# EAGLE design V4-AddOnZigbee-SMD-V001 (EAGLE 9.3.0)
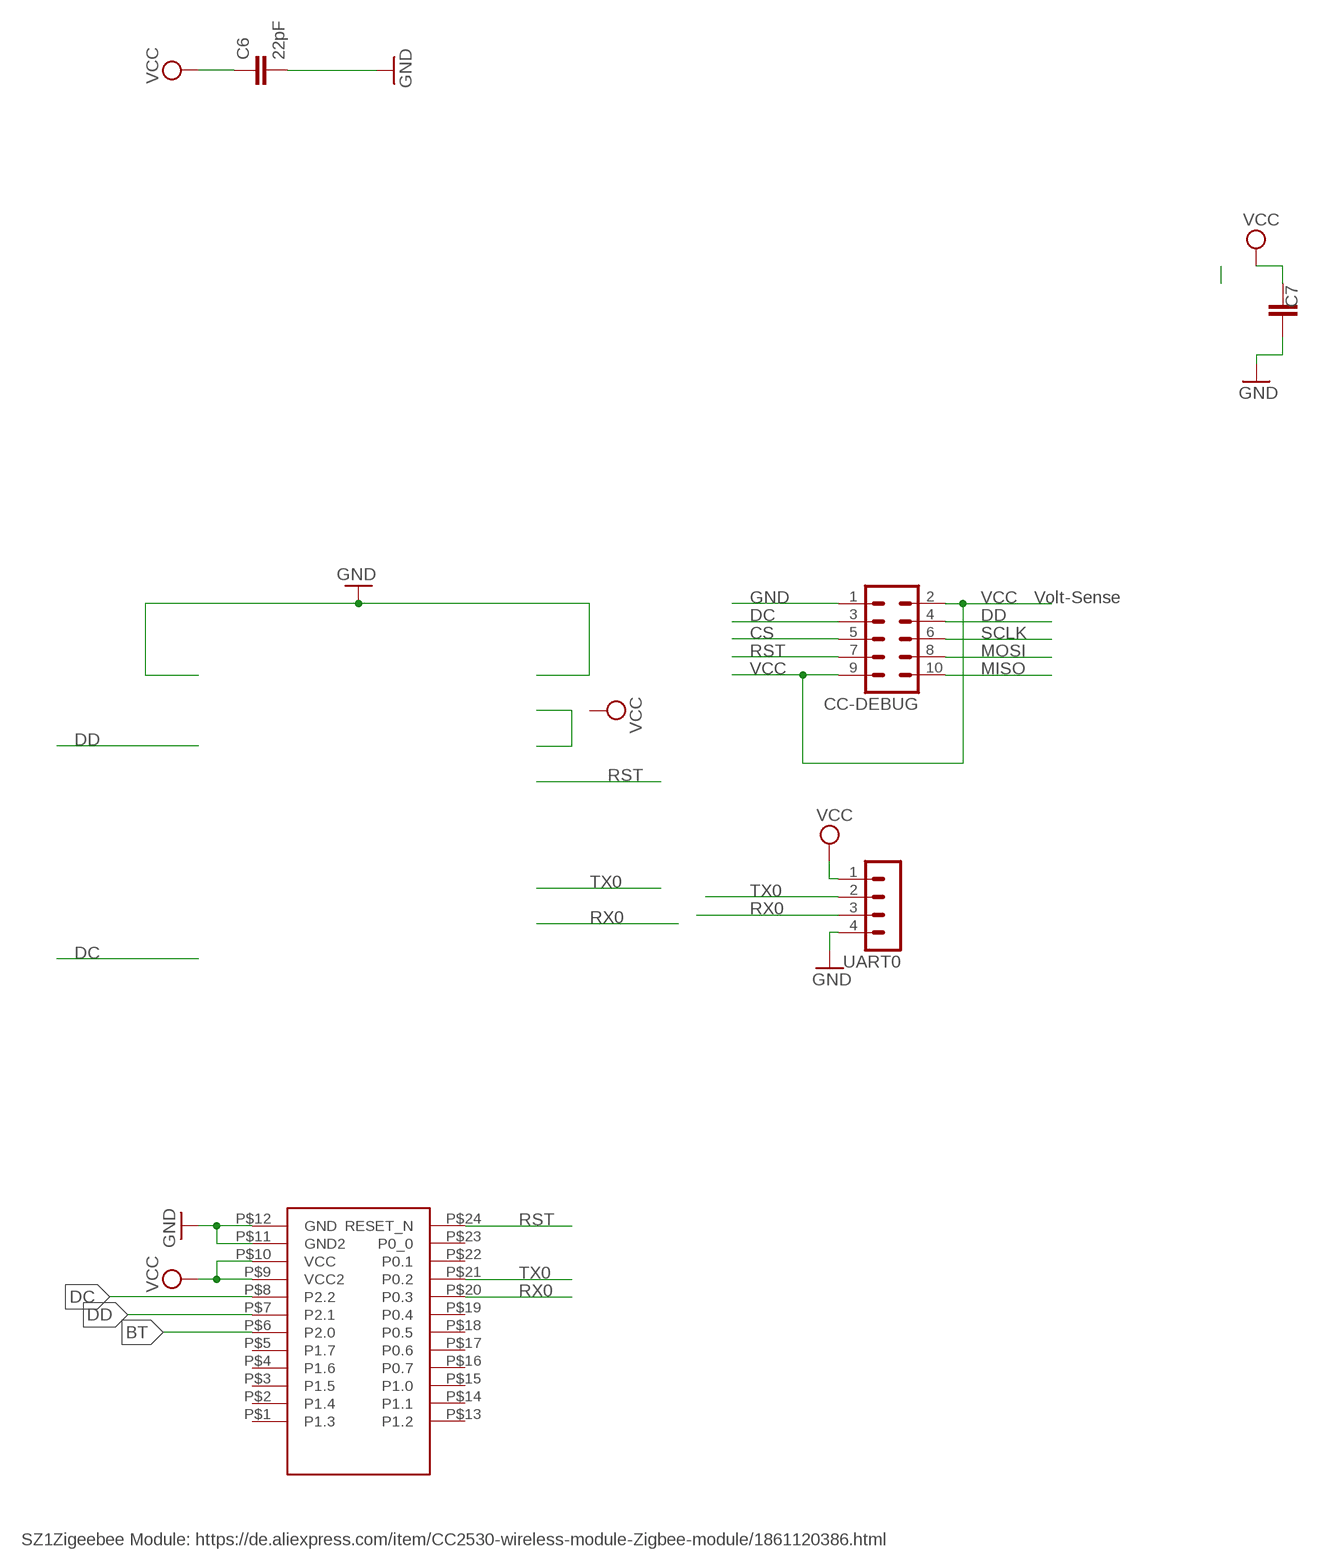
[diagram p0: schematic, sheet 1]

## Parts
C6  22pF  C-EUC0805  [C0805]
C7  C-EUC1812  [C1812]
CC-DEBUG  MA05-2  [MA05-2]
U$1  CC2530CC2530PA  [CC2530PA]
UART0  MA04-1  [MA04-1]

## Nets
BT: U$1.P$6(P2.0)
CS: CC-DEBUG.5
DC: CC-DEBUG.3 U$1.P$8(P2.2)
DD: CC-DEBUG.4 U$1.P$7(P2.1)
GND [PWR]: C6.2 C7.1 CC-DEBUG.1 U$1.P$11(GND2) U$1.P$12(GND) UART0.4
MISO: CC-DEBUG.10
MOSI: CC-DEBUG.8
RST: CC-DEBUG.7 U$1.P$24(RESET_N)
RX0: U$1.P$20(P0.3) UART0.3
SCLK: CC-DEBUG.6
TX0: U$1.P$21(P0.2) UART0.2
VCC [PWR]: C6.1 C7.2 CC-DEBUG.2 CC-DEBUG.9 U$1.P$9(VCC2) U$1.P$10(VCC) UART0.1
Unconnected: U$1.P$1(P1.3) U$1.P$2(P1.4) U$1.P$3(P1.5) U$1.P$4(P1.6) U$1.P$5(P1.7) U$1.P$13(P1.2) U$1.P$14(P1.1) U$1.P$15(P1.0) U$1.P$16(P0.7) U$1.P$17(P0.6) U$1.P$18(P0.5) U$1.P$19(P0.4) U$1.P$22(P0.1) U$1.P$23(P0_0)

## Notes on the sheet
- Volt-Sense
- SZ1Zigeebee Module: https://de.aliexpress.com/item/CC2530-wireless-module-Zigbee-module/1861120386.html

## Library data of the parts
C6 C7 = rcl:C-EU: CAPACITOR, European symbol; SPICEPREFIX: C
CC-DEBUG = con-lstb:MA05-2: PIN HEADER; OC_FARNELL: unknown; OC_NEWARK: unknown
U$1 = zigbee:CC2530: CC2530 Wireless Zigbee Module 3.0-3.6V 2.405-2.485GHz
UART0 = con-lstb:MA04-1: PIN HEADER; OC_FARNELL: unknown; OC_NEWARK: unknown

## Net classes
0 default: width 0.305 mm
1 PWR: width 0.61 mm

## Board
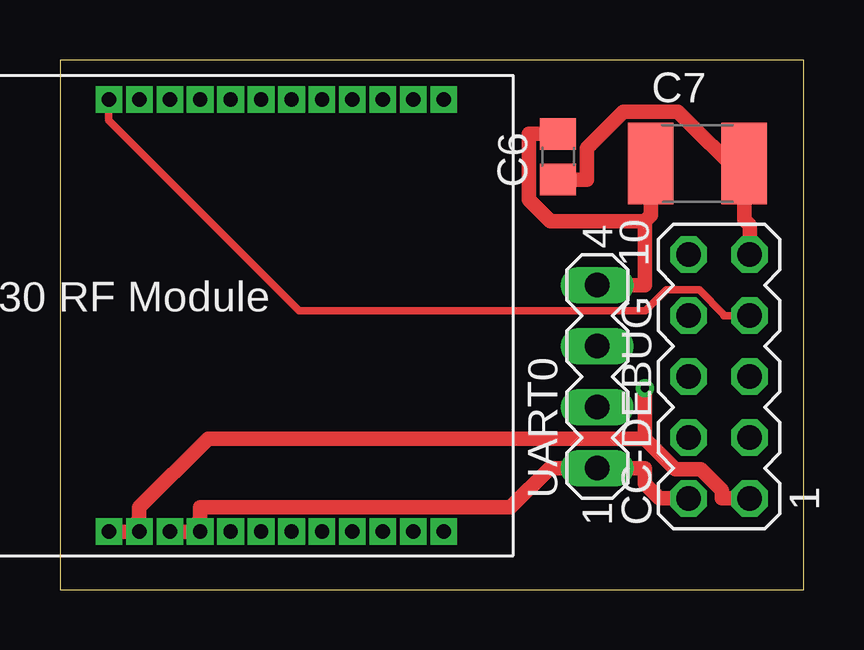
[diagram p1: board, top side]
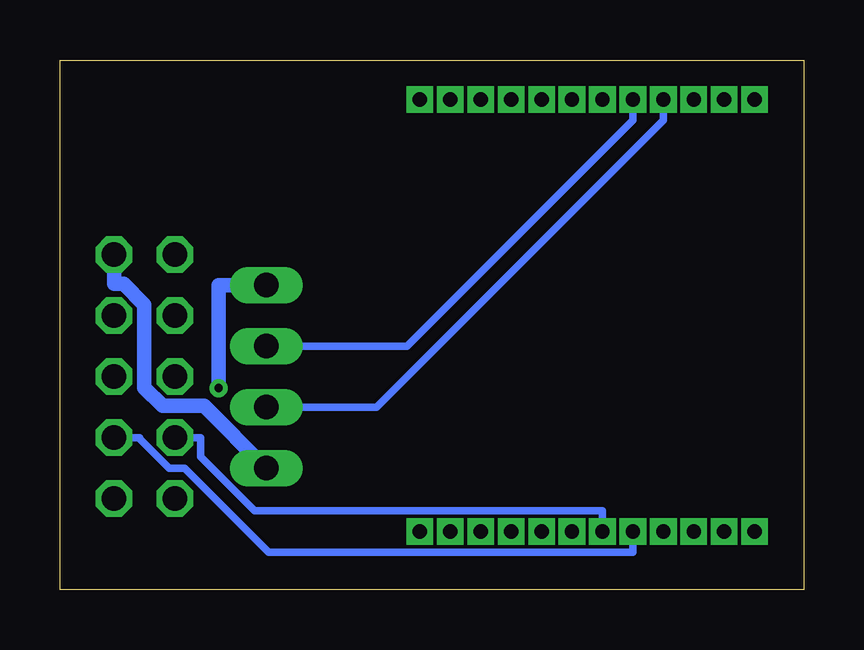
[diagram p2: board, bottom side, seen from below]

Size 31 x 22.08 mm. Coordinates in mm from the lower left corner, seen from the top.
Outline: 0,0 31,0 31,22.08 0,22.08 0,0
Copper layers (1*16): Top 0.035mm / dielectric 1.5mm / Bottom 0.035mm
Design rules "default": minimum track width 6mil, minimum drill 0.35mm, track to track 6mil, track to pad 6mil, pad to pad 6mil, via to via 6mil, smd to smd 6mil, copper to edge 40mil, drill to drill 6mil, minimum pad ring 10mil, minimum via ring 8mil, stop-mask expansion 4mil, vias tented up to drill 0mil, thermal gap 10mil

### Footprints (pad centres in the part's own frame; a part is rotated, then mirrored left to right if it is on the bottom)
C0805 = smd 1.3 x 1.5: 1 -0.95,0; 2 0.95,0
C1812 = smd 1.9 x 3.4: 1 -1.95,0; 2 1.95,0
MA05-2 = drill 1.016 octagon: 1 -5.08,-1.27; 2 -5.08,1.27; 3 -2.54,-1.27; 4 -2.54,1.27; 5 0,-1.27; 6 0,1.27; 7 2.54,-1.27; 8 2.54,1.27; 9 5.08,-1.27; 10 5.08,1.27
CC2530PA = drill 0.6 pad 0.813 square: P$1 -9,-17.1; P$2 -9,-15.83; P$3 -9,-14.56; P$4 -9,-13.29; P$5 -9,-12.02; P$6 -9,-10.75; P$7 -9,-9.48; P$8 -9,-8.21; P$9 -9,-6.94; P$10 -9,-5.67; P$11 -9,-4.4; P$12 -9,-3.13; P$13 9,-17.1; P$14 9,-15.83; P$15 9,-14.56; P$16 9,-13.29; P$17 9,-12.02; P$18 9,-10.75; P$19 9,-9.48; P$20 9,-8.21; P$21 9,-6.94; P$22 9,-5.67; P$23 9,-4.4; P$24 9,-3.13
MA04-1 = drill 1.016 long: 1 -3.81,0; 2 -1.27,0; 3 1.27,0; 4 3.81,0

### Placement (x,y rotation side)
C6  20.77,18.05 90 top
C7  26.57,17.77 0 top
CC-DEBUG  27.48,8.89 90 top
U$1  -1.09,11.43 90 top
UART0  22.4,8.89 90 top

### Tracks (layer width: path | path; a pad name or v marks a point on that pad's centre or on a via)
DC
  Bottom 0.305: CC-DEBUG.3 27.68,6.35 27.68,6.31 26.45,5.08 25.8,5.08 22.3,1.57 7.12,1.57 U$1.P$8
DD
  Bottom 0.305: CC-DEBUG.4 25.14,6.35 25.14,5.55 22.89,3.29 8.38,3.29 U$1.P$7
GND  (via drill 0.35 pad 0.76)
  Top 0.61: v24.39,8.41 24.39,6.31 | 24.39,6.31 6.17,6.31 3.3,3.44 3.3,2.94 | 24.39,6.31 25.66,5.03 26.71,5.03 27.6,4.15 27.6,3.81 CC-DEBUG.1 | U$1.P$12 3.05,2.43 3.05,2.68 3.3,2.94 | U$1.P$11 3.3,2.94 | 24.38,15.36 24.62,15.61 C7.1 | 24.38,15.36 24.38,12.7 UART0.4 | 24.38,15.36 20.45,15.36 19.56,16.25 19.56,19 C6.2
  Bottom 0.61: v24.39,8.41 v24.38,8.41 24.38,12.7 UART0.4
RST
  Top 0.305: CC-DEBUG.7 27.68,11.43 27.68,11.47 26.65,12.5 25.28,12.5 24.41,11.63 9.97,11.63 2.04,19.57 U$1.P$24
RX0
  Bottom 0.305: U$1.P$20 7.12,19.57 16.53,10.16 UART0.3
TX0
  Bottom 0.305: U$1.P$21 5.85,19.57 17.8,7.62 UART0.2
VCC
  Top 0.61: CC-DEBUG.9 28.75,15.19 28.52,15.41 28.52,16.69 | U$1.P$10 5.59,2.43 5.59,2.68 5.85,2.94 | 5.85,2.94 5.85,3.44 18.78,3.44 20.42,5.08 UART0.1 24.38,5.08 24.38,4.42 24.99,3.81 CC-DEBUG.2 | U$1.P$9 5.85,2.94 | C6.1 21.97,17.1 21.97,18.41 23.48,19.92 25.77,19.92 28.52,17.17 28.52,16.69 | C7.2 28.52,16.69
  Bottom 0.61: CC-DEBUG.9 28.75,12.75 28.34,12.75 27.48,11.89 27.48,8.43 26.72,7.67 24.99,7.67 UART0.1